# Altium schematic sheet vi.schdoc
size 84 x 102 mm
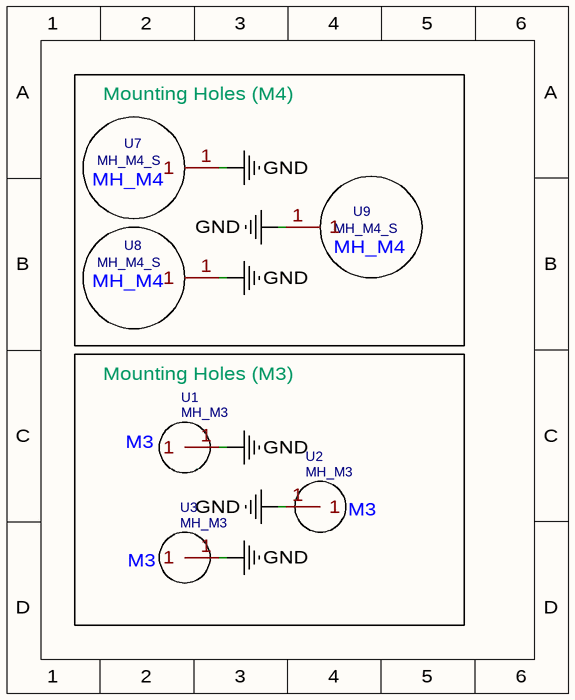
[diagram p0: vi.schdoc]

## Parts
U1  MH_M3  [MH_M3_PCB]
U2  MH_M3  [MH_M3_PCB]
U3  MH_M3  [MH_M3_PCB]
U7  MH_M4_S  [MH_M4_PCB]
U8  MH_M4_S  [MH_M4_PCB]
U9  MH_M4_S  [MH_M4_PCB]

## Blocks framed on the sheet
Mounting Holes (M4): U7-U9
Mounting Holes (M3): U1-U3

## Nets
GND: U1.1 U2.1 U3.1 U7.1 U8.1 U9.1

## Notes on the sheet
- (in symbol MH_M3) M3
- (in symbol MH_M4_S) MH_M4

## Library data of the parts
U1-U3 = MH_M3: Contributor: js314dev; spicePre: U; spiceSymbolName: MH_M3
U7-U9 = MH_M4_S: Contributor: js314dev; spicePre: U; spiceSymbolName: MH_M4_S